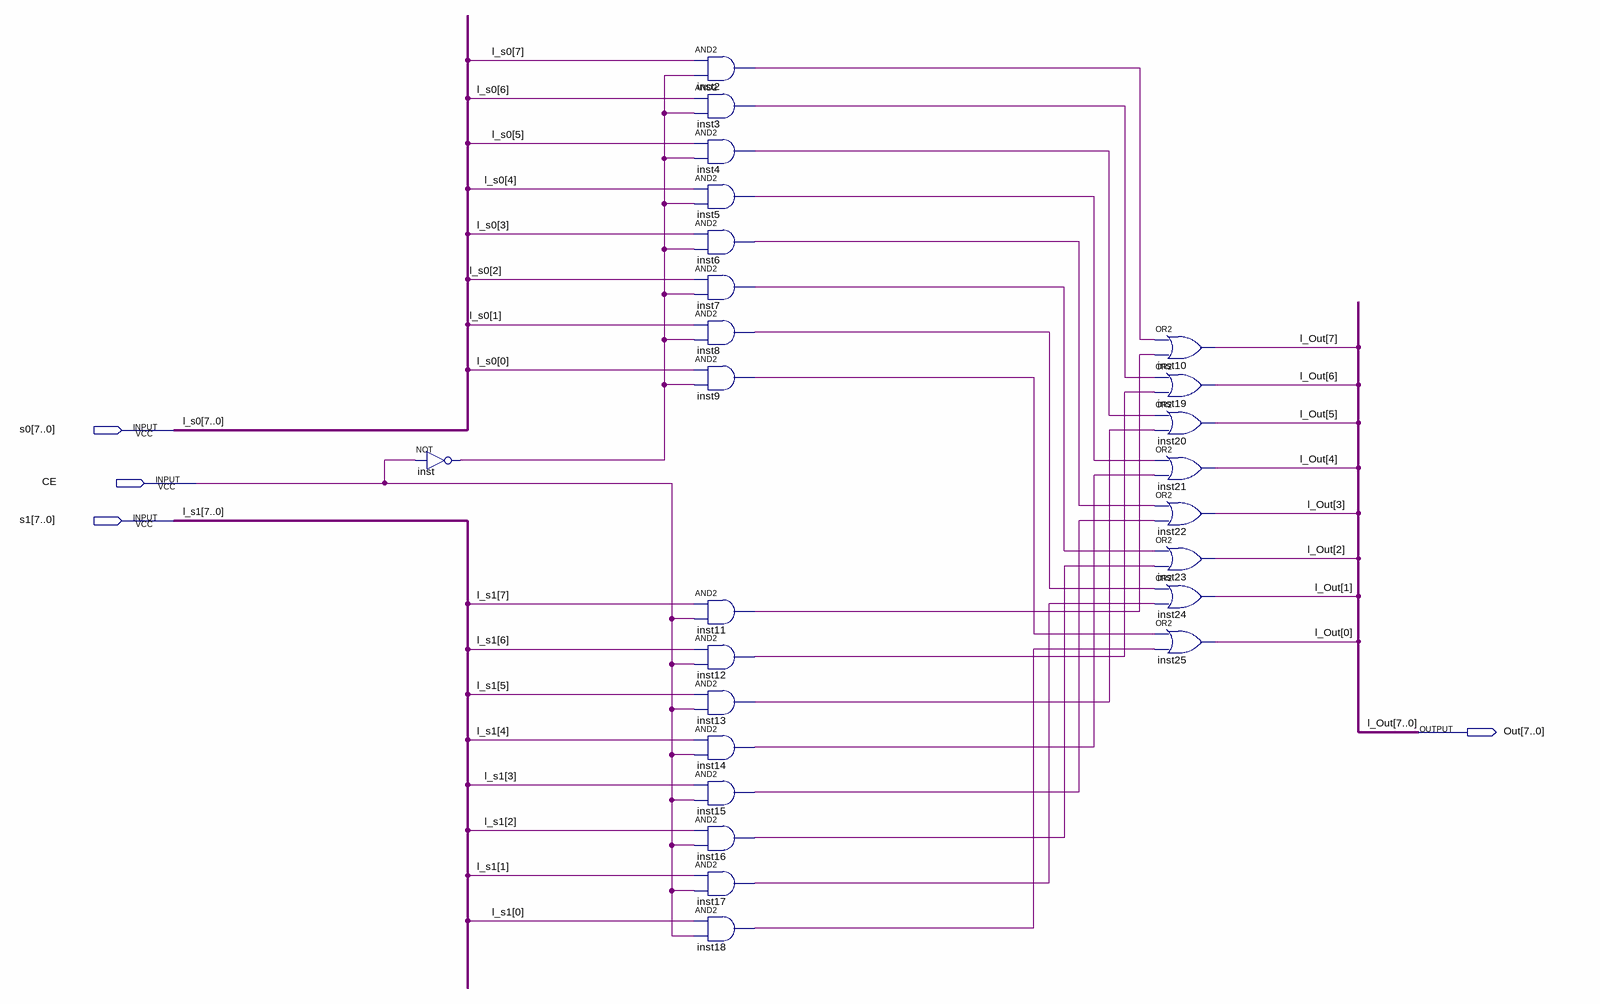
[diagram p0: schematic sheet]
// Quartus schematic mux_8bit_2x1.bdf as structural Verilog: 25 symbols, 4 pins
module mux_8bit_2x1 (
  input  [7:0] s0,
  input  CE,
  input  [7:0] s1,
  output [7:0] Out
);

  wire inst2_out, inst3_out, inst4_out, inst5_out, inst6_out, inst7_out, inst8_out, inst9_out, inst11_out,
       inst12_out, inst13_out, inst14_out, inst15_out, inst16_out, inst17_out, inst18_out, inst_out;

  not inst (inst_out, CE);
  and inst2 (inst2_out, s0[7], inst_out);
  and inst3 (inst3_out, s0[6], inst_out);
  and inst4 (inst4_out, s0[5], inst_out);
  and inst5 (inst5_out, s0[4], inst_out);
  and inst6 (inst6_out, s0[3], inst_out);
  and inst7 (inst7_out, s0[2], inst_out);
  and inst8 (inst8_out, s0[1], inst_out);
  and inst9 (inst9_out, s0[0], inst_out);
  and inst11 (inst11_out, s1[7], CE);
  and inst12 (inst12_out, s1[6], CE);
  and inst13 (inst13_out, s1[5], CE);
  and inst14 (inst14_out, s1[4], CE);
  and inst15 (inst15_out, s1[3], CE);
  and inst16 (inst16_out, s1[2], CE);
  and inst17 (inst17_out, s1[1], CE);
  and inst18 (inst18_out, s1[0], CE);
  or inst10 (Out[7], inst2_out, inst11_out);
  or inst19 (Out[6], inst3_out, inst12_out);
  or inst20 (Out[5], inst4_out, inst13_out);
  or inst21 (Out[4], inst5_out, inst14_out);
  or inst22 (Out[3], inst6_out, inst15_out);
  or inst23 (Out[2], inst7_out, inst16_out);
  or inst24 (Out[1], inst8_out, inst17_out);
  or inst25 (Out[0], inst9_out, inst18_out);

  // Other names for the same wires on the sheet: l_Out[7:0] = Out; l_s0[7:0] = s0; l_s1[7:0] = s1
endmodule
